# EAGLE schematic pro-base (EAGLE 9.6.2), part 1 of 2
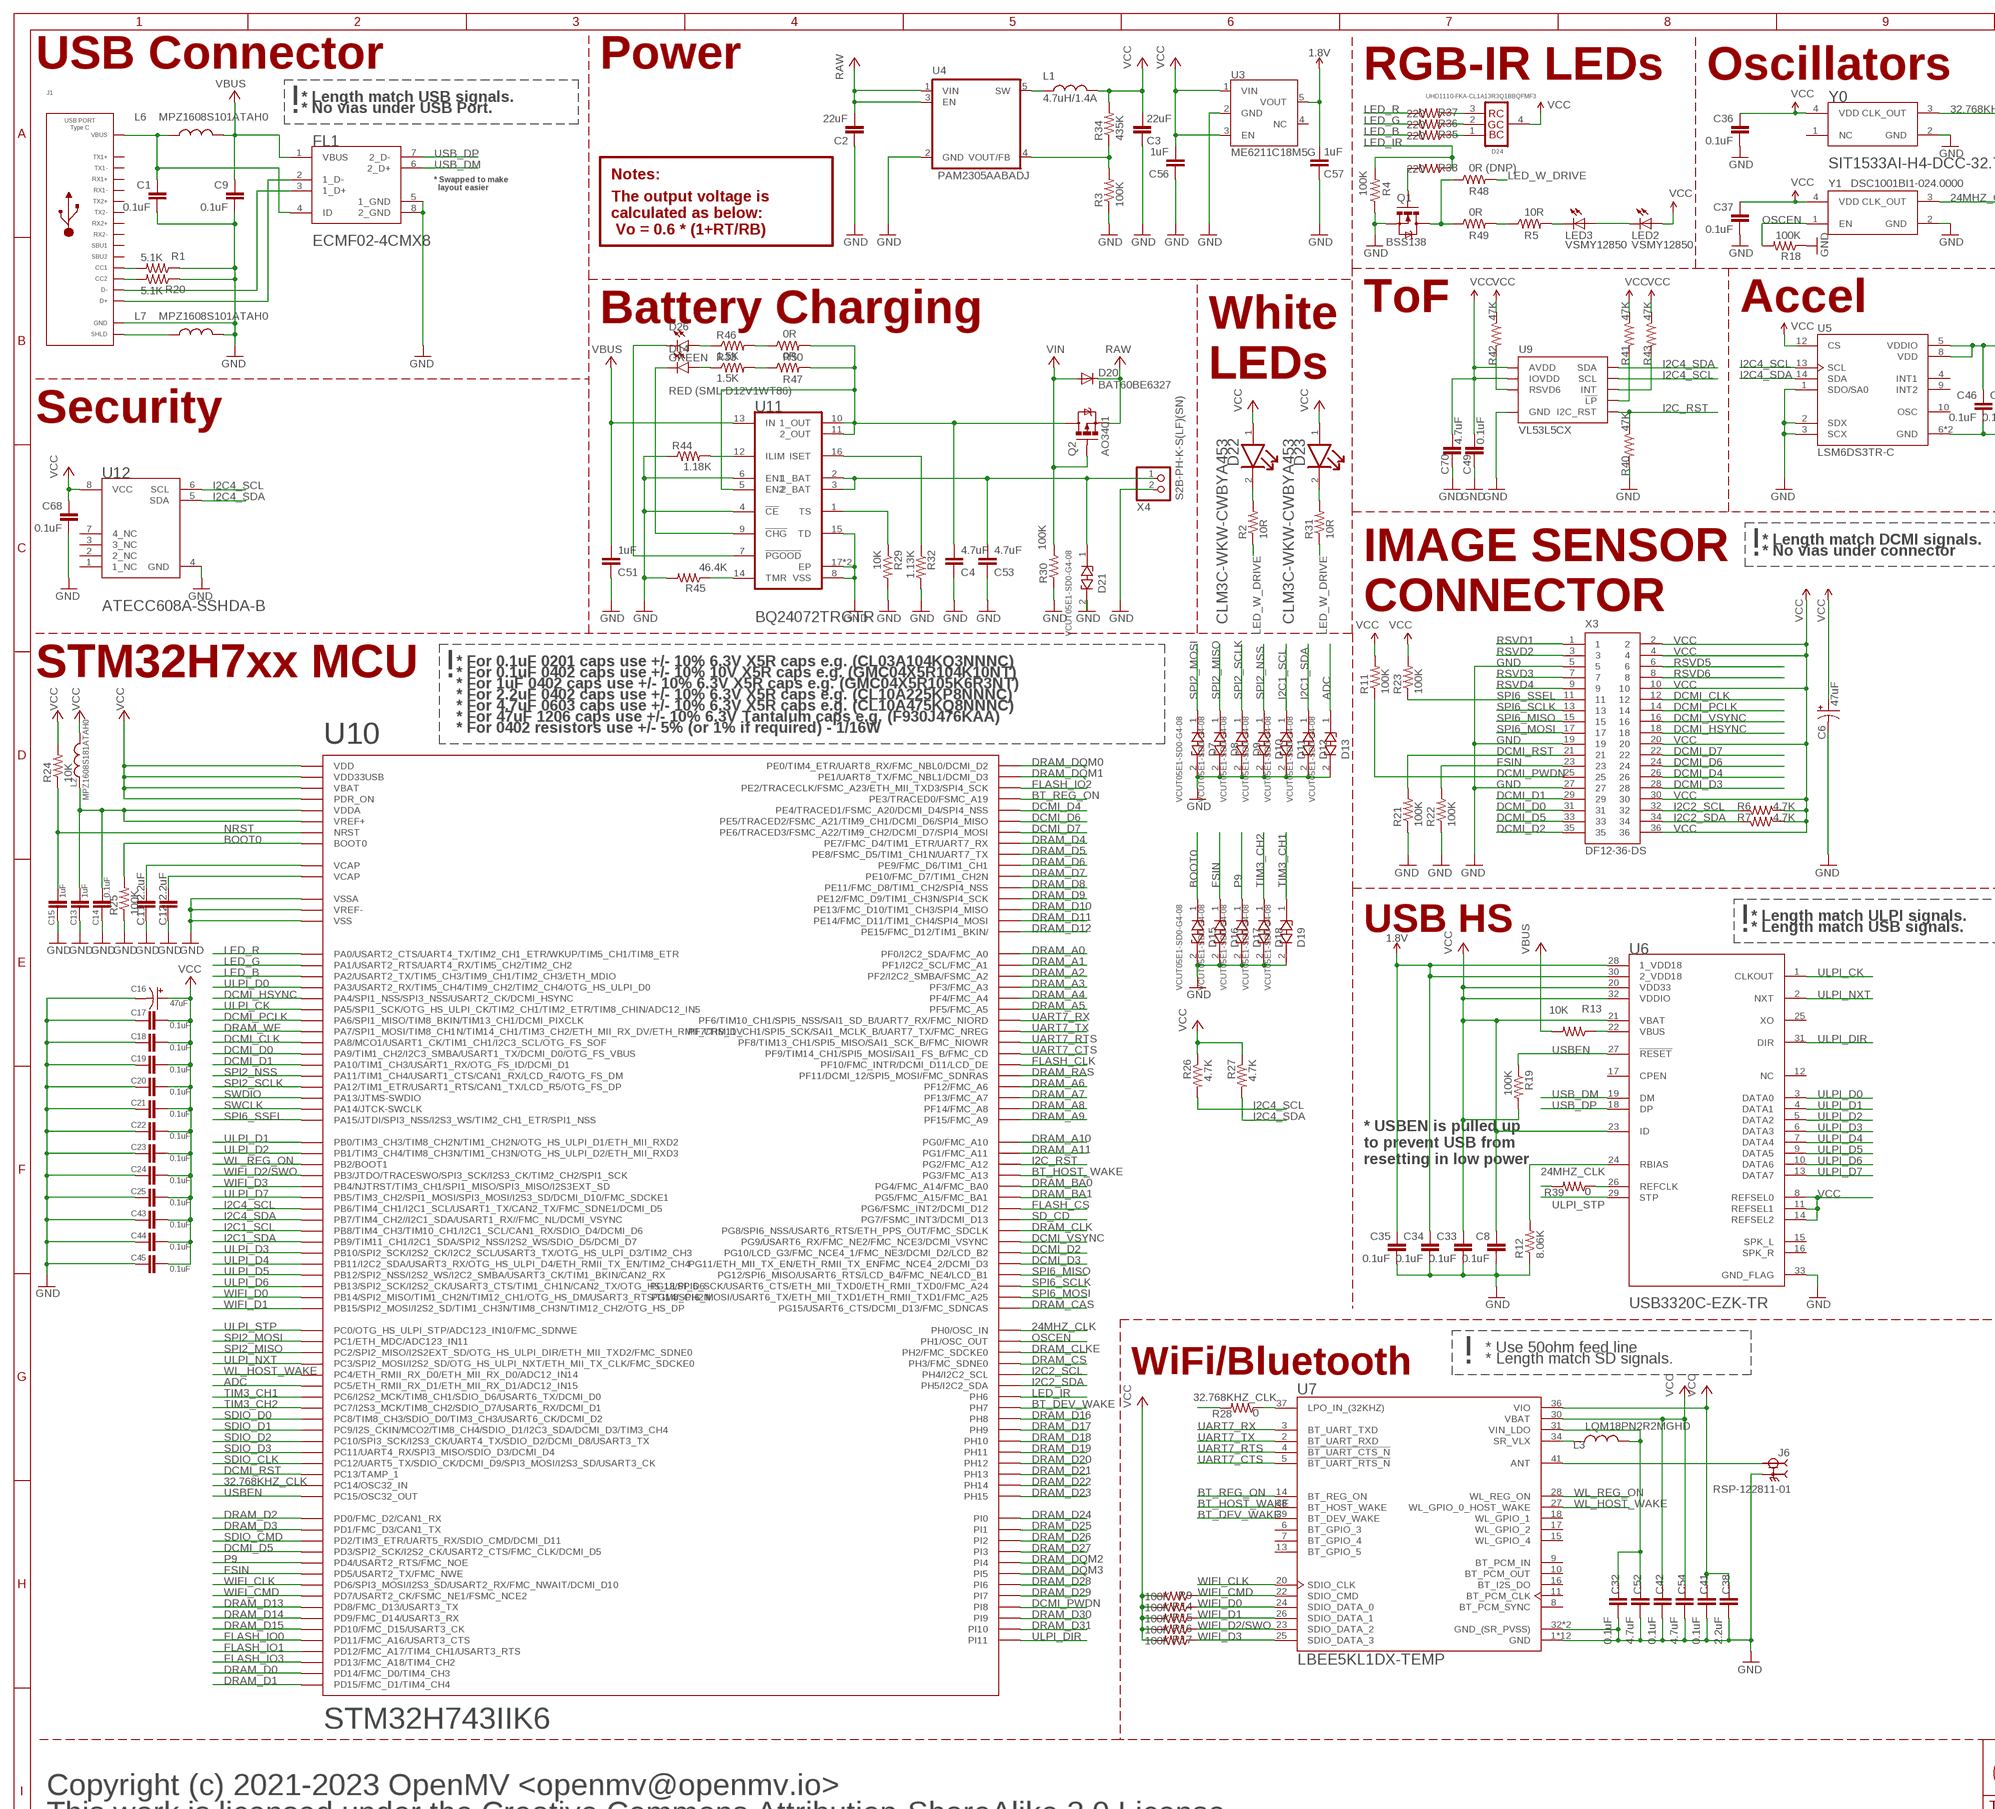
[diagram p0: schematic, sheet 1, part 1 of 2]
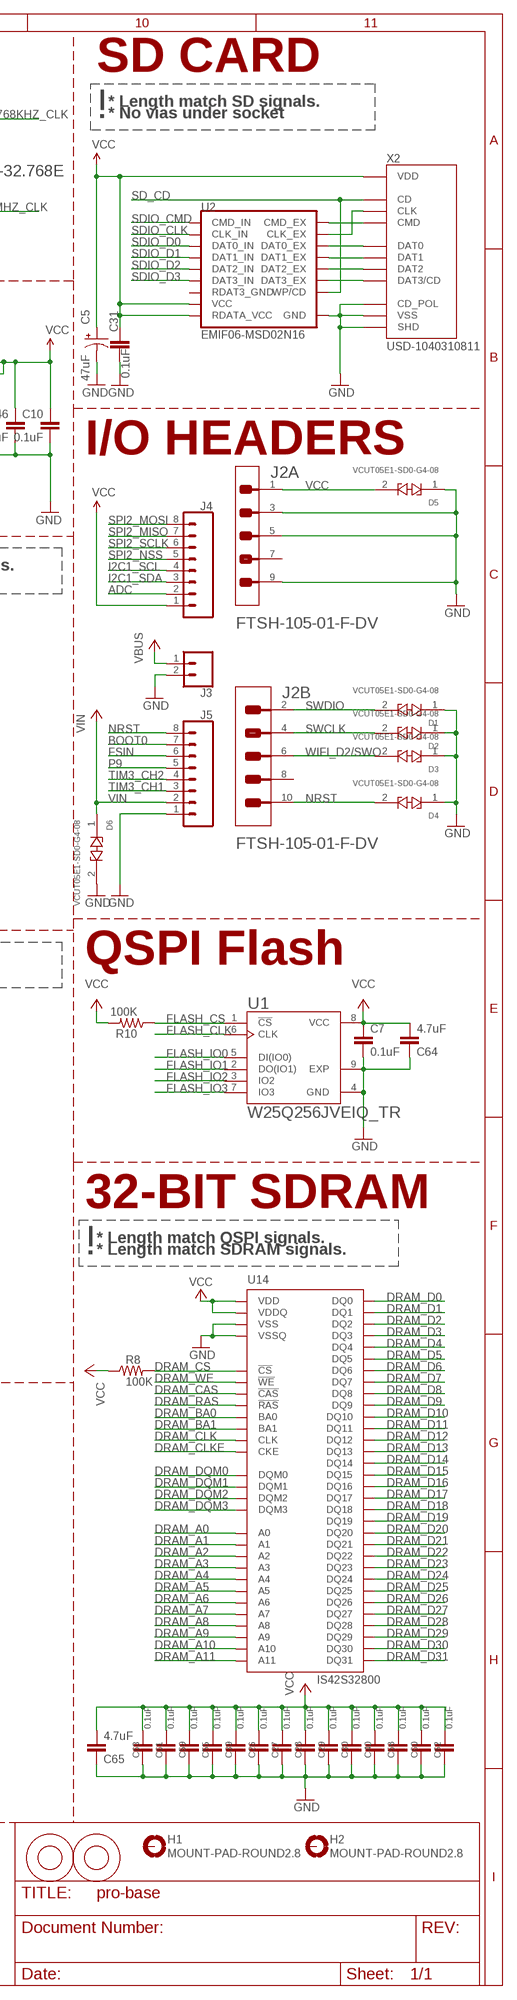
[diagram p1: schematic, sheet 1, part 2 of 2]

## Parts
C1  0.1uF  CAP0402-CAP  [0402-CAP]
C2  22uF  CAP0805  [0805]
C3  22uF  CAP0805  [0805]
C4  4.7uF  4.7UF0603  [0603]
C5  47uF  CAP_POL1206  [EIA3216]
C6  47uF  CAP_POL1206  [EIA3216]
C7  0.1uF  CAP0402-CAP  [0402-CAP]
C8  0.1uF  CAP0402-CAP  [0402-CAP]
C9  0.1uF  CAP0402-CAP  [0402-CAP]
C10  0.1uF  CAP0402-CAP  [0402-CAP]
C11  2.2uF  CAP0402-CAP  [0402-CAP]
C12  2.2uF  CAP0402-CAP  [0402-CAP]
C13  1uF  CAP0402-CAP  [0402-CAP]
C14  0.1uF  CAP0402-CAP  [0402-CAP]
C15  1uF  CAP0402-CAP  [0402-CAP]
C16  47uF  CAP_POL1206  [EIA3216]
C17  0.1uF  C-EUC0201  [C0201]
C18  0.1uF  C-EUC0201  [C0201]
C19  0.1uF  C-EUC0201  [C0201]
C20  0.1uF  C-EUC0201  [C0201]
C21  0.1uF  C-EUC0201  [C0201]
C22  0.1uF  C-EUC0201  [C0201]
C23  0.1uF  C-EUC0201  [C0201]
C24  0.1uF  C-EUC0201  [C0201]
C25  0.1uF  C-EUC0201  [C0201]
C26  0.1uF  C-EUC0201  [C0201]
C27  0.1uF  C-EUC0201  [C0201]
C28  0.1uF  C-EUC0201  [C0201]
C29  0.1uF  C-EUC0201  [C0201]
C30  0.1uF  C-EUC0201  [C0201]
C31  0.1uF  CAP0402-CAP  [0402-CAP]
C32  0.1uF  CAP0402-CAP  [0402-CAP]
C33  0.1uF  CAP0402-CAP  [0402-CAP]
C34  0.1uF  CAP0402-CAP  [0402-CAP]
C35  0.1uF  CAP0402-CAP  [0402-CAP]
C36  0.1uF  CAP0402-CAP  [0402-CAP]
C37  0.1uF  CAP0402-CAP  [0402-CAP]
C38  2.2uF  CAP0402-CAP  [0402-CAP]
C39  0.1uF  C-EUC0201  [C0201]
C40  0.1uF  C-EUC0201  [C0201]
C41  0.1uF  CAP0402-CAP  [0402-CAP]
C42  0.1uF  CAP0402-CAP  [0402-CAP]
C43  0.1uF  C-EUC0201  [C0201]
C44  0.1uF  C-EUC0201  [C0201]
C45  0.1uF  C-EUC0201  [C0201]
C46  0.1uF  CAP0402-CAP  [0402-CAP]
C49  0.1uF  CAP0402-CAP  [0402-CAP]
C51  1uF  CAP0402-CAP  [0402-CAP]
C52  4.7uF  4.7UF0603  [0603]
C53  4.7uF  4.7UF0603  [0603]
C54  4.7uF  4.7UF0603  [0603]
C55  0.1uF  C-EUC0201  [C0201]
C56  1uF  CAP0402-CAP  [0402-CAP]
C57  1uF  CAP0402-CAP  [0402-CAP]
C58  0.1uF  C-EUC0201  [C0201]
C59  0.1uF  C-EUC0201  [C0201]
C60  0.1uF  C-EUC0201  [C0201]
C61  0.1uF  C-EUC0201  [C0201]
C62  0.1uF  C-EUC0201  [C0201]
C63  0.1uF  C-EUC0201  [C0201]
C64  4.7uF  4.7UF0603  [0603]
C65  4.7uF  4.7UF0603  [0603]
C68  0.1uF  CAP0402-CAP  [0402-CAP]
C70  4.7uF  4.7UF0603  [0603]
D1  VISHAY_VCUT05E1-SD0-G4-08VISHAY_VCUT05E1-SD0-G4-08_0_0  [VISHAY_VCUT05E1-SD0-G4-08_0]
D2  VISHAY_VCUT05E1-SD0-G4-08VISHAY_VCUT05E1-SD0-G4-08_0_0  [VISHAY_VCUT05E1-SD0-G4-08_0]
D3  VISHAY_VCUT05E1-SD0-G4-08VISHAY_VCUT05E1-SD0-G4-08_0_0  [VISHAY_VCUT05E1-SD0-G4-08_0]
D4  VISHAY_VCUT05E1-SD0-G4-08VISHAY_VCUT05E1-SD0-G4-08_0_0  [VISHAY_VCUT05E1-SD0-G4-08_0]
D5  VISHAY_VCUT05E1-SD0-G4-08VISHAY_VCUT05E1-SD0-G4-08_0_0  [VISHAY_VCUT05E1-SD0-G4-08_0]
D6  VISHAY_VCUT05E1-SD0-G4-08VISHAY_VCUT05E1-SD0-G4-08_0_0  [VISHAY_VCUT05E1-SD0-G4-08_0]
D7  VISHAY_VCUT05E1-SD0-G4-08VISHAY_VCUT05E1-SD0-G4-08_0_0  [VISHAY_VCUT05E1-SD0-G4-08_0]
D8  VISHAY_VCUT05E1-SD0-G4-08VISHAY_VCUT05E1-SD0-G4-08_0_0  [VISHAY_VCUT05E1-SD0-G4-08_0]
D9  VISHAY_VCUT05E1-SD0-G4-08VISHAY_VCUT05E1-SD0-G4-08_0_0  [VISHAY_VCUT05E1-SD0-G4-08_0]
D10  VISHAY_VCUT05E1-SD0-G4-08VISHAY_VCUT05E1-SD0-G4-08_0_0  [VISHAY_VCUT05E1-SD0-G4-08_0]
D11  VISHAY_VCUT05E1-SD0-G4-08VISHAY_VCUT05E1-SD0-G4-08_0_0  [VISHAY_VCUT05E1-SD0-G4-08_0]
D12  VISHAY_VCUT05E1-SD0-G4-08VISHAY_VCUT05E1-SD0-G4-08_0_0  [VISHAY_VCUT05E1-SD0-G4-08_0]
D13  VISHAY_VCUT05E1-SD0-G4-08VISHAY_VCUT05E1-SD0-G4-08_0_0  [VISHAY_VCUT05E1-SD0-G4-08_0]
D14  RED (SML-D12V1WT86)  LED-RED0603  [LED-0603]
D15  VISHAY_VCUT05E1-SD0-G4-08VISHAY_VCUT05E1-SD0-G4-08_0_0  [VISHAY_VCUT05E1-SD0-G4-08_0]
D16  VISHAY_VCUT05E1-SD0-G4-08VISHAY_VCUT05E1-SD0-G4-08_0_0  [VISHAY_VCUT05E1-SD0-G4-08_0]
D17  VISHAY_VCUT05E1-SD0-G4-08VISHAY_VCUT05E1-SD0-G4-08_0_0  [VISHAY_VCUT05E1-SD0-G4-08_0]
D18  VISHAY_VCUT05E1-SD0-G4-08VISHAY_VCUT05E1-SD0-G4-08_0_0  [VISHAY_VCUT05E1-SD0-G4-08_0]
D19  VISHAY_VCUT05E1-SD0-G4-08VISHAY_VCUT05E1-SD0-G4-08_0_0  [VISHAY_VCUT05E1-SD0-G4-08_0]
D20  BAT60BE6327  DIODESOD  [SOD-323]
D21  VISHAY_VCUT05E1-SD0-G4-08VISHAY_VCUT05E1-SD0-G4-08_0_0  [VISHAY_VCUT05E1-SD0-G4-08_0]
D22  CREE_CLM3C-WKW-CWBYA453CREE_CLM3C-WKW-CWBYA453_0_0  [CREE_CLM3C-WKW-CWBYA453_0]
D23  CREE_CLM3C-WKW-CWBYA453CREE_CLM3C-WKW-CWBYA453_0_0  [CREE_CLM3C-WKW-CWBYA453_0]
D24  CREE_UHD1110-FKA-CL1A13R3Q1BBQFMF3CREE_UHD1110-FKA-CL1A13R3Q1BBQFMF3_0_0  [CREE_UHD1110-FKA-CL1A13R3Q1BBQFMF3_0]
D26  GREEN  LED-GREEN0603  [LED-0603]
FL1  STMICROELECTRONICS_ECMF02-4CMX8STMICROELECTRONICS_ECMF02-4CMX8_0_0  [STMICROELECTRONICS_ECMF02-4CMX8_0]
H1  MOUNT-PAD-ROUND2.8  [2,8-PAD]
H2  MOUNT-PAD-ROUND2.8  [2,8-PAD]
J1  USB_TYPE-C_105450-0101  [105450-0101]
J2  SAMTEC_FTSH-105-01-F-DVSAMTEC_FTSH-105-01-F-DV_0_0  [SAMTEC_FTSH-105-01-F-DV_0]
J3  CONN_02  [1X02]
J4  CONN_08"  [1X08]
J5  CONN_08"  [1X08]
J6  RSP-122811-01  [SAMTEC_RSP-122811-01]
L1  4.7uH/1.4A  INDUCTOR1007  [1007]
L2  MPZ1608S181ATAH0  INDUCTOR0402  [C0402]
L3  LQM18PN2R2MGHD  INDUCTOR0603  [0603]
L6  MPZ1608S101ATAH0  INDUCTOR0402  [C0402]
L7  MPZ1608S101ATAH0  INDUCTOR0402  [C0402]
LED2  VSMY12850  LED1206  [LED-1206]
LED3  VSMY12850  LED1206  [LED-1206]
M1  9774030243R  9774030151R  [9774030151R]
M2  9774030243R  9774030151R  [9774030151R]
Q1  BSS138  MOSFET-NCHANNELSMD  [SOT23-3]
Q2  AO3401  MOSFET-PCHANNELSMD  [SOT23-3]
R1  5.1K  RESISTOR0402-RES  [0402-RES]
R2  10R  RESISTOR0402-RES  [0402-RES]
R3  100K  RESISTOR0402-RES  [0402-RES]
R4  100K  RESISTOR0402-RES  [0402-RES]
R5  10R  RESISTOR0402-RES  [0402-RES]
R6  4.7K  RESISTOR0402-RES  [0402-RES]
R7  4.7K  RESISTOR0402-RES  [0402-RES]
R8  100K  RESISTOR0402-RES  [0402-RES]
R9  100K  RESISTOR0402-RES  [0402-RES]
R10  100K  RESISTOR0402-RES  [0402-RES]
R11  100K  RESISTOR0402-RES  [0402-RES]
R12  8.06K  RESISTOR0402-RES  [0402-RES]
R13  10K  RESISTOR0402-RES  [0402-RES]
R14  100K  RESISTOR0402-RES  [0402-RES]
R15  100K  RESISTOR0402-RES  [0402-RES]
R16  100K  RESISTOR0402-RES  [0402-RES]
R17  100K  RESISTOR0402-RES  [0402-RES]
R18  100K  RESISTOR0402-RES  [0402-RES]
R19  100K  RESISTOR0402-RES  [0402-RES]
R20  5.1K  RESISTOR0402-RES  [0402-RES]
R21  100K  RESISTOR0402-RES  [0402-RES]
R22  100K  RESISTOR0402-RES  [0402-RES]
R23  100K  RESISTOR0402-RES  [0402-RES]
R24  10K  RESISTOR0402-RES  [0402-RES]
R25  100K  RESISTOR0402-RES  [0402-RES]
R26  4.7K  RESISTOR0402-RES  [0402-RES]
R27  4.7K  RESISTOR0402-RES  [0402-RES]
R28  0  RESISTOR0402-RES  [0402-RES]
R29  10K  RESISTOR0402-RES  [0402-RES]
R30  100K  RESISTOR0402-RES  [0402-RES]
R31  10R  RESISTOR0402-RES  [0402-RES]
R32  1.13K  RESISTOR0402-RES  [0402-RES]
R33  1.5K  RESISTOR0402-RES  [0402-RES]
R34  435K  RESISTOR0402-RES  [0402-RES]
R35  220  RESISTOR0402-RES  [0402-RES]
R36  220  RESISTOR0402-RES  [0402-RES]
R37  220  RESISTOR0402-RES  [0402-RES]
R38  220  RESISTOR0402-RES  [0402-RES]
R39  0  RESISTOR0402-RES  [0402-RES]
R40  47K  RESISTOR0402-RES  [0402-RES]
R41  47K  RESISTOR0402-RES  [0402-RES]
R42  47K  RESISTOR0402-RES  [0402-RES]
R43  47K  RESISTOR0402-RES  [0402-RES]
R44  1.18K  RESISTOR0402-RES  [0402-RES]
R45  46.4K  RESISTOR0402-RES  [0402-RES]
R46  1.5K  RESISTOR0402-RES  [0402-RES]
R47  0R  RESISTOR0402-RES  [0402-RES]
R48  0R (DNP)  RESISTOR0402-RES  [0402-RES]
R49  0R  RESISTOR0402-RES  [0402-RES]
R50  0R  RESISTOR0402-RES  [0402-RES]
U1  W25Q256JVEIQ_TR  [SON127P800X600X80-9N]
U2  EMIF06-MSD02N16  [QFN3.5]
U3  ME6211C18M5G  ME6211TSOT-5  [SOT23-5]
U4  PAM2305AABADJ  PAM2305AAB330  [TSOT25]
U5  LSM6DS3TR-C  LSM6DS3  [PQFN50P300X250X86-14N]
U6  MICROCHIP_USB3320C-EZK-TRMICROCHIP_USB3320C-EZK-TR_0_1  [MICROCHIP_USB3320C-EZK-TR_1]
U7  LBEE5KL1DX-TEMP  [XCVR_LBEE5KL1DX-TEMP]
U9  VL53L5CX  [VL53L5CX]
U10  STM32H743IIK6  [UFGBGA-176]
U11  TEXAS_INSTRUMENTS_BQ24072TRGTRTEXAS_INSTRUMENTS_BQ24072TRGTR_0_0  [TEXAS_INSTRUMENTS_BQ24072TRGTR_0]
U12  MICROCHIP_ATECC608A-SSHDA-BMICROCHIP_ATECC608A-SSHDA-B_0_0  [MICROCHIP_ATECC608A-SSHDA-B_0]
U14  IS42S32800  [BGA90]
X2  USD-1040310811  [1040310811]
X3  DF12-36-DS  [DF12-36-DS]
X4  S2B-PH-K-S(LF)(SN)  JST_2PIN-THM-RA  [JST-PH-2-THM-RA]
Y0  SITIME_SIT1533AI-H4-DCC-32.768ESITIME_SIT1533AI-H4-DCC-32.768E_0_0  [SITIME_SIT1533AI-H4-DCC-32.768E_0]
Y1  DSC1001BI1-024.0000  OSC_DSC6083CI2A-032K768  [OSC_DSC6083CI2A-032K768]

## Nets
1.8V: C34.1 C35.1 C57.2 U3.5(VOUT) U6.28(1_VDD18) U6.30(2_VDD18)
24MHZ_CLK: R39.2 U10.G1(PH0/OSC_IN) Y1.3(CLK_OUT)
32.768KHZ_CLK: R28.2 U10.E1(PC14/OSC32_IN) Y0.3(CLK_OUT)
ADC: D13.1 J4.2 U10.P5(PC5/ETH_RMII_RX_D1/ETH_MII_RX_D1/ADC12_IN15)
ANT_PI_I: J6.1 U7.41(ANT)
BAT: C53.2 D21.1 U11.2(1_BAT) U11.3(2_BAT) X4.1
BOOT0: D15.1 J5.7 R25.2 U10.D6(BOOT0)
BT_DEV_WAKE: U7.39(BT_DEV_WAKE) U10.N12(PH7)
BT_HOST_WAKE: U7.38(BT_HOST_WAKE) U10.K15(PG3/FMC_A13)
BT_REG_ON: U7.14(BT_REG_ON) U10.A1(PE3/TRACED0/FSMC_A19)
CC1: J1.A5(CC1) R1.2
CC2: J1.B5(CC2) R20.2
CHG: D14.C U11.9(!CHG!)
CLK: U2.P$11(CLK_EX) X2.P$5(CLK)
CMD: U2.P$12(CMD_EX) X2.P$3(CMD)
DAT0: U2.P$10(DAT0_EX) X2.P$7(DAT0)
DAT1: U2.P$9(DAT1_EX) X2.P$8(DAT1)
DAT2: U2.P$14(DAT2_EX) X2.P$1(DAT2)
DAT3: U2.P$13(DAT3_EX) X2.P$2(DAT3/CD)
DCMI_CLK: U10.F15(PA8/MCO1/USART1_CK/TIM1_CH1/I2C3_SCL/OTG_FS_SOF) X3.12
DCMI_D0 [dcmi_data]: U10.E15(PA9/TIM1_CH2/I2C3_SMBA/USART1_TX/DCMI_D0/OTG_FS_VBUS) X3.31
DCMI_D1 [dcmi_data]: U10.D15(PA10/TIM1_CH3/USART1_RX/OTG_FS_ID/DCMI_D1) X3.29
DCMI_D2 [dcmi_data]: U10.B10(PG10/LCD_G3/FMC_NCE4_1/FMC_NE3/DCMI_D2/LCD_B2) X3.35
DCMI_D3 [dcmi_data]: U10.B9(PG11/ETH_MII_TX_EN/ETH_RMII_TX_ENFMC_NCE4_2/DCMI_D3) X3.28
DCMI_D4 [dcmi_data]: U10.B1(PE4/TRACED1/FSMC_A20/DCMI_D4/SPI4_NSS) X3.26
DCMI_D5 [dcmi_data]: U10.D11(PD3/SPI2_SCK/I2S2_CK/USART2_CTS/FMC_CLK/DCMI_D5) X3.33
DCMI_D6 [dcmi_data]: U10.B2(PE5/TRACED2/FSMC_A21/TIM9_CH1/DCMI_D6/SPI4_MISO) X3.24
DCMI_D7 [dcmi_data]: U10.B3(PE6/TRACED3/FSMC_A22/TIM9_CH2/DCMI_D7/SPI4_MOSI) X3.22
DCMI_HSYNC: U10.N4(PA4/SPI1_NSS/SPI3_NSS/USART2_CK/DCMI_HSYNC) X3.18
DCMI_PCLK: U10.P3(PA6/SPI1_MISO/TIM8_BKIN/TIM13_CH1/DCMI_PIXCLK) X3.14
DCMI_PWDN: R11.1 U10.D2(PI8) X3.25
DCMI_RST: R21.2 U10.D1(PC13/TAMP_1) X3.21
DCMI_VSYNC: U10.C10(PG9/USART6_RX/FMC_NE2/FMC_NCE3/DCMI_VSYNC) X3.16
DN: FL1.3(1_D+) J1.A7(D-) J1.B7(D-)
DP: FL1.2(1_D-) J1.A6(D+) J1.B6(D+)
DRAM_A0 [sdram_cmd]: U10.E2(PF0/I2C2_SDA/FMC_A0) U14.G8(A0)
DRAM_A1 [sdram_cmd]: U10.H3(PF1/I2C2_SCL/FMC_A1) U14.G9(A1)
DRAM_A2 [sdram_cmd]: U10.H2(PF2/I2C2_SMBA/FSMC_A2) U14.F7(A2)
DRAM_A3 [sdram_cmd]: U10.J2(PF3/FMC_A3) U14.F3(A3)
DRAM_A4 [sdram_cmd]: U10.J3(PF4/FMC_A4) U14.G1(A4)
DRAM_A5 [sdram_cmd]: U10.K3(PF5/FMC_A5) U14.G2(A5)
DRAM_A6 [sdram_cmd]: U10.P6(PF12/FMC_A6) U14.G3(A6)
DRAM_A7 [sdram_cmd]: U10.N6(PF13/FMC_A7) U14.H1(A7)
DRAM_A8 [sdram_cmd]: U10.R7(PF14/FMC_A8) U14.H2(A8)
DRAM_A9 [sdram_cmd]: U10.P7(PF15/FMC_A9) U14.J3(A9)
DRAM_A10 [sdram_cmd]: U10.N7(PG0/FMC_A10) U14.G7(A10)
DRAM_A11 [sdram_cmd]: U10.M7(PG1/FMC_A11) U14.H9(A11)
DRAM_BA0 [sdram_cmd]: U10.K14(PG4/FMC_A14/FMC_BA0) U14.J7(BA0)
DRAM_BA1 [sdram_cmd]: U10.K13(PG5/FMC_A15/FMC_BA1) U14.H8(BA1)
DRAM_CAS [sdram_cmd]: U10.B7(PG15/USART6_CTS/DCMI_D13/FMC_SDNCAS) U14.K7(!CAS)
DRAM_CLK [sdram_cmd]: U10.H14(PG8/SPI6_NSS/USART6_RTS/ETH_PPS_OUT/FMC_SDCLK) U14.J1(CLK)
DRAM_CLKE [sdram_cmd]: U10.F4(PH2/FMC_SDCKE0) U14.J2(CKE)
DRAM_CS [sdram_cmd]: R8.2 U10.G4(PH3/FMC_SDNE0) U14.J8(!CS)
DRAM_D0 [sdram_data]: U10.M14(PD14/FMC_D0/TIM4_CH3) U14.R8(DQ0)
DRAM_D1 [sdram_data]: U10.L14(PD15/FMC_D1/TIM4_CH4) U14.N7(DQ1)
DRAM_D2 [sdram_data]: U10.B12(PD0/FMC_D2/CAN1_RX) U14.R9(DQ2)
DRAM_D3 [sdram_data]: U10.C12(PD1/FMC_D3/CAN1_TX) U14.N8(DQ3)
DRAM_D4 [sdram_data]: U10.R8(PE7/FMC_D4/TIM1_ETR/UART7_RX) U14.P9(DQ4)
DRAM_D5 [sdram_data]: U10.P8(PE8/FSMC_D5/TIM1_CH1N/UART7_TX) U14.M8(DQ5)
DRAM_D6 [sdram_data]: U10.P9(PE9/FMC_D6/TIM1_CH1) U14.M7(DQ6)
DRAM_D7 [sdram_data]: U10.R9(PE10/FMC_D7/TIM1_CH2N) U14.L8(DQ7)
DRAM_D8 [sdram_data]: U10.P10(PE11/FMC_D8/TIM1_CH2/SPI4_NSS) U14.L2(DQ8)
DRAM_D9 [sdram_data]: U10.R10(PE12/FMC_D9/TIM1_CH3N/SPI4_SCK) U14.M3(DQ9)
DRAM_D10 [sdram_data]: U10.N11(PE13/FMC_D10/TIM1_CH3/SPI4_MISO) U14.M2(DQ10)
DRAM_D11 [sdram_data]: U10.P11(PE14/FMC_D11/TIM1_CH4/SPI4_MOSI) U14.P1(DQ11)
DRAM_D12 [sdram_data]: U10.R11(PE15/FMC_D12/TIM1_BKIN/) U14.N2(DQ12)
DRAM_D13 [sdram_data]: U10.P15(PD8/FMC_D13/USART3_TX) U14.R1(DQ13)
DRAM_D14 [sdram_data]: U10.P14(PD9/FMC_D14/USART3_RX) U14.N3(DQ14)
DRAM_D15 [sdram_data]: U10.N15(PD10/FMC_D15/USART3_CK) U14.R2(DQ15)
DRAM_D16 [sdram_data]: U10.M12(PH8) U14.E8(DQ16)
DRAM_D17 [sdram_data]: U10.M13(PH9) U14.D7(DQ17)
DRAM_D18 [sdram_data]: U10.L13(PH10) U14.D8(DQ18)
DRAM_D19 [sdram_data]: U10.L12(PH11) U14.B9(DQ19)
DRAM_D20 [sdram_data]: U10.K12(PH12) U14.C8(DQ20)
DRAM_D21 [sdram_data]: U10.E12(PH13) U14.A9(DQ21)
DRAM_D22 [sdram_data]: U10.E13(PH14) U14.C7(DQ22)
DRAM_D23 [sdram_data]: U10.D13(PH15) U14.A8(DQ23)
DRAM_D24 [sdram_data]: U10.E14(PI0) U14.A2(DQ24)
DRAM_D25 [sdram_data]: U10.D14(PI1) U14.C3(DQ25)
DRAM_D26 [sdram_data]: U10.C14(PI2) U14.A1(DQ26)
DRAM_D27 [sdram_data]: U10.C13(PI3) U14.C2(DQ27)
DRAM_D28 [sdram_data]: U10.C3(PI6) U14.B1(DQ28)
DRAM_D29 [sdram_data]: U10.C2(PI7) U14.D2(DQ29)
DRAM_D30 [sdram_data]: U10.D3(PI9) U14.D3(DQ30)
DRAM_D31 [sdram_data]: U10.E3(PI10) U14.E2(DQ31)
DRAM_DQM0 [sdram_cmd]: U10.A4(PE0/TIM4_ETR/UART8_RX/FMC_NBL0/DCMI_D2) U14.K9(DQM0)
DRAM_DQM1 [sdram_cmd]: U10.A3(PE1/UART8_TX/FMC_NBL1/DCMI_D3) U14.K1(DQM1)
DRAM_DQM2 [sdram_cmd]: U10.D4(PI4) U14.F8(DQM2)
DRAM_DQM3 [sdram_cmd]: U10.C4(PI5) U14.F2(DQM3)
DRAM_RAS [sdram_cmd]: U10.R6(PF11/DCMI_12/SPI5_MOSI/FMC_SDNRAS) U14.J9(!RAS)
DRAM_WE [sdram_cmd]: U10.R3(PA7/SPI1_MOSI/TIM8_CH1N/TIM14_CH1/TIM3_CH2/ETH_MII_RX_DV/ETH_RMII_CRS_DV) U14.K8(!WE)
FB [power]: R3.2 R34.1 U4.4(VOUT/FB)
FLASH_CLK: U1.6(CLK) U10.L1(PF10/FMC_INTR/DCMI_D11/LCD_DE)
FLASH_CS: R10.1 U1.1(!CS) U10.J15(PG6/FSMC_INT2/DCMI_D12)
FLASH_IO0: U1.5(DI(IO0)) U10.N14(PD11/FMC_A16/USART3_CTS)
FLASH_IO1: U1.2(DO(IO1)) U10.N13(PD12/FMC_A17/TIM4_CH1/USART3_RTS)
FLASH_IO2: U1.3(IO2) U10.A2(PE2/TRACECLK/FSMC_A23/ETH_MII_TXD3/SPI4_SCK)
FLASH_IO3: U1.7(IO3) U10.M15(PD13/FMC_A18/TIM4_CH2)
FSIN: D16.1 J5.6 R22.2 U10.C11(PD5/USART2_TX/FMC_NWE) X3.23
GND [gnd]: C1.2 C2.1 C3.1 C4.1 C5.C(-) C6.C(-) C7.2 C8.2 C9.2 C10.2 C11.2 C12.2 C13.2 C14.2 C15.2 C16.C(-) C17.2 C18.2 C19.2 C20.2 C21.2 C22.2 C23.2 C24.2 C25.2 C26.2 C27.2 C28.2 C29.2 C30.2 C31.2 C32.2 C33.2 C34.2 C35.2 C36.2 C37.2 C38.2 C39.2 C40.2 C41.2 C42.2 C43.2 C44.2 C45.2 C46.2 C49.2 C51.1 C52.2 C53.1 C54.2 C55.2 C56.1 C57.1 C58.2 C59.2 C60.2 C61.2 C62.2 C63.2 C64.1 C65.1 C68.2 C70.1 D1.1 D2.1 D3.1 D4.1 D5.1 D6.2 D7.2 D8.2 D9.2 D10.2 D11.2 D12.2 D13.2 D15.2 D16.2 D17.2 D18.2 D19.2 D21.2 FL1.5(1_GND) FL1.8(2_GND) J1.A1(GND) J1.A12(GND) J1.B1(GND) J1.B12(GND) J2.3 J2.5 J2.9 J3.2 J5.1 J6.G1(GND) J6.G2(GND) L7.2 Q1.2(S) R1.1 R3.1 R4.1 R12.1 R18.1 R20.1 R21.1 R22.1 R25.1 R29.2 R30.1 R32.2 R40.2 R44.1 R45.2 U1.4(GND) U1.9(EXP) U2.GND U3.2(GND) U4.2(GND) U5.1(SDO/SA0) U5.2(SDX) U5.3(SCX) U5.6(GND) U5.7(GND) U6.33(GND_FLAG) U7.1(GND) U7.12(GND) U7.19(GND) U7.21(GND) U7.29(GND) U7.32(GND_(SR_PVSS)) U7.33(GND_(SR_PVSS)) U7.35(GND) U7.40(GND) U7.42(GND) U7.43(GND) U7.44(GND) U7.45(GND) U7.46(GND) U9.A2(GND) U9.A6(GND) U9.A7(GND) U9.B4(GND) U9.C1(GND) U9.C6(GND) U9.C7(GND) U10.D5(VSS) U10.D7(VSS) U10.D8(VSS) U10.D9(VSS) U10.F2(VSS) U10.F6(VSS) U10.F7(VSS) U10.F8(VSS) U10.F9(VSS) U10.F10(VSS) U10.F12(VSS) U10.G2(VSS) U10.G6(VSS) U10.G7(VSS) U10.G8(VSS) U10.G9(VSS) U10.G10(VSS) U10.G12(VSS) U10.H6(VSS) U10.H7(VSS) U10.H8(VSS) U10.H9(VSS) U10.H10(VSS) U10.H12(VSS) U10.J6(VSS) U10.J7(VSS) U10.J8(VSS) U10.J9(VSS) U10.J10(VSS) U10.K6(VSS) U10.K7(VSS) U10.K8(VSS) U10.K9(VSS) U10.K10(VSS) U10.L4(VSS) U10.M1(VSSA) U10.M8(VSS) U10.M9(VSS) U10.N1(VREF-) U11.4(!CE!) U11.6(EN1) U11.8(VSS) U11.15(TD) U11.17(EP) U11.17-2(EP) U12.4(GND) U14.A3(VSS) U14.B3(VSSQ) U14.B8(VSSQ) U14.C1(VSSQ) U14.D1(VSSQ) U14.E9(VSSQ) U14.F1(VSS) U14.L3(VSS) U14.L9(VSSQ) U14.M1(VSSQ) U14.N1(VSSQ) U14.P3(VSSQ) U14.P8(VSSQ) U14.R3(VSS) X2.CD$2(CD_POL) X2.G$1(SHD) X2.G$2(SHD) X2.G$3(SHD) X2.G$4(SHD) X2.P$6(VSS) X3.5 X3.19 X3.27 X4.2 Y0.2(GND) Y1.2(GND)
I2C1_SCL: D11.1 J4.4 U10.A5(PB8/TIM4_CH3/TIM10_CH1/I2C1_SCL/CAN1_RX/SDIO_D4/DCMI_D6)
I2C1_SDA: D12.1 J4.3 U10.B4(PB9/TIM11_CH1/I2C1_SDA/SPI2_NSS/I2S2_WS/SDIO_D5/DCMI_D7)
I2C2_SCL: R6.2 U10.H4(PH4/I2C2_SCL) X3.32
I2C2_SDA: R7.2 U10.J4(PH5/I2C2_SDA) X3.34
I2C4_SCL: R26.2 U5.13(SCL) U9.C4(SCL) U10.B6(PB6/TIM4_CH1/I2C1_SCL/USART1_TX/CAN2_TX/FMC_SDNE1/DCMI_D5) U12.6(SCL)
I2C4_SDA: R27.2 U5.14(SDA) U9.C3(SDA) U10.B5(PB7/TIM4_CH2//I2C1_SDA/USART1_RX//FMC_NL/DCMI_VSYNC) U12.5(SDA)
I2C_RST: R40.1 U9.A1(I2C_RST) U10.L15(PG2/FMC_A12)
ISET: R32.1 U11.16(ISET)
LED_B: R35.2 U10.P2(PA2/USART2_TX/TIM5_CH3/TIM9_CH1/TIM2_CH3/ETH_MDIO)
LED_B_INT: D24.1(BLUE_CATHODE) R35.1
LED_DRAIN: Q1.3(D) R48.1 R49.1
LED_G: R36.2 U10.N2(PA1/USART2_RTS/UART4_RX/TIM5_CH2/TIM2_CH2)
LED_G_INT: D24.2(GREEN_CATHODE) R36.1
LED_IR: R4.2 R38.1 U10.M11(PH6)
LED_IR_DRIVE: R5.1 R49.2
LED_IR_DRIVE_0: LED3.C R5.2
LED_IR_DRIVE_1: LED2.C LED3.A
LED_IR_INT: Q1.1(G) R38.2
LED_R: R37.2 U10.N3(PA0/USART2_CTS/UART4_TX/TIM2_CH1_ETR/WKUP/TIM5_CH1/TIM8_ETR)
LED_R_INT: D24.3(RED_CATHODE) R37.1
LED_W_DRIVE: R2.1 R31.1 R48.2
LED_W_DRIVE_0: D22.2(CATHODE) R2.2
LED_W_DRIVE_1: D23.2(CATHODE) R31.2
N$1: D26.A R46.1
N$2: R28.1 U7.37(LPO_IN_(32KHZ))
N$3: R39.1 U6.26(REFCLK)
N$4: R44.2 U11.12(ILIM)
N$5: R41.2 U9.A5(!LP)
N$6: R42.2 U9.C2(RSVD6)
N$7: R43.2 U9.A3(INT)
N$8: R45.1 U11.14(TMR)
N$9: D26.C U11.7(!PGOOD!)
N$10: D14.A R33.1
N$11: R33.2 R47.1
N$12: R46.2 R50.1
NRST: C15.1 D4.2 J2.10 J5.8 R24.1 U10.J1(NRST)
OSCEN: R18.2 U10.H1(PH1/OSC_OUT) Y1.1(EN)
OUT [power]: C4.2 Q2.3(D) R47.2 R50.2 U11.5(EN2) U11.10(1_OUT) U11.11(2_OUT)
P9: D17.1 J5.5 U10.D10(PD4/USART2_RTS/FMC_NOE)
RAW: C2.2 D20.1(C) Q2.2(S) U4.1(VIN) U4.3(EN)
RBIAS: R12.2 U6.24(RBIAS)
RSVD1: X3.1
RSVD2: X3.3
RSVD3: X3.7
RSVD4: X3.9
RSVD5: X3.6
RSVD6: X3.8
SD_CD: U2.P$1(WP/CD) U10.J14(PG7/FSMC_INT3/DCMI_D13) X2.CD$1(CD)
SDIO_CLK: U2.P$6(CLK_IN) U10.A12(PC12/UART5_TX/SDIO_CK/DCMI_D9/SPI3_MOSI/I2S3_SD/USART3_CK)
SDIO_CMD: U2.P$5(CMD_IN) U10.D12(PD2/TIM3_ETR/UART5_RX/SDIO_CMD/DCMI_D11)
SDIO_D0: U2.P$7(DAT0_IN) U10.G14(PC8/TIM8_CH3/SDIO_D0/TIM3_CH3/USART6_CK/DCMI_D2)
SDIO_D1: U2.P$8(DAT1_IN) U10.F14(PC9/I2S_CKIN/MCO2/TIM8_CH4/SDIO_D1/I2C3_SDA/DCMI_D3/TIM3_CH4)
SDIO_D2: U2.P$3(DAT2_IN) U10.B14(PC10/SPI3_SCK/I2S3_CK/UART4_TX/SDIO_D2/DCMI_D8/USART3_TX)
SDIO_D3: U2.P$4(DAT3_IN) U10.B13(PC11/UART4_RX/SPI3_MISO/SDIO_D3/DCMI_D4)
SHIELD_INT: J1.S_T1(SHLD) J1.S_T2(SHLD) J1.S_T3(SHLD) J1.S_T4(SHLD) L7.1
SPI2_MISO: D8.1 J4.7 U10.M4(PC2/SPI2_MISO/I2S2EXT_SD/OTG_HS_ULPI_DIR/ETH_MII_TXD2/FMC_SDNE0)
SPI2_MOSI: D7.1 J4.8 U10.M3(PC1/ETH_MDC/ADC123_IN11)
SPI2_NSS: D10.1 J4.5 U10.C15(PA11/TIM1_CH4/USART1_CTS/CAN1_RX/LCD_R4/OTG_FS_DM)
SPI2_SCLK: D9.1 J4.6 U10.B15(PA12/TIM1_ETR/USART1_RTS/CAN1_TX/LCD_R5/OTG_FS_DP)
SPI6_MISO: U10.B8(PG12/SPI6_MISO/USART6_RTS/LCD_B4/FMC_NE4/LCD_B1) X3.15
SPI6_MOSI: U10.A7(PG14/SPI6_MOSI/USART6_TX/ETH_MII_TXD1/ETH_RMII_TXD1/FMC_A25) X3.17
SPI6_SCLK: U10.A8(PG13/SPI6_SCK/USART6_CTS/ETH_MII_TXD0/ETH_RMII_TXD0/FMC_A24) X3.13
SPI6_SSEL: R23.1 U10.A13(PA15/JTDI/SPI3_NSS/I2S3_WS/TIM2_CH1_ETR/SPI1_NSS) X3.11
SR)VLX: L3.1 U7.34(SR_VLX)
SW: L1.1 U4.5(SW)
SWCLK: D2.2 J2.4 U10.A14(PA14/JTCK-SWCLK)
SWDIO: D1.2 J2.2 U10.A15(PA13/JTMS-SWDIO)
TIM3_CH1: D19.1 J5.3 U10.H15(PC6/I2S2_MCK/TIM8_CH1/SDIO_D6/USART6_TX/DCMI_D0)
TIM3_CH2: D18.1 J5.4 U10.G15(PC7/I2S3_MCK/TIM8_CH2/SDIO_D7/USART6_RX/DCMI_D1)
TS: R29.1 U11.1(TS)
UART7_CTS: U7.5(!BT_UART_RTS_N) U10.L2(PF9/TIM14_CH1/SPI5_MOSI/SAI1_FS_B/FMC_CD)
UART7_RTS: U7.4(!BT_UART_CTS_N) U10.L3(PF8/TIM13_CH1/SPI5_MISO/SAI1_SCK_B/FMC_NIOWR)
UART7_RX: U7.3(BT_UART_TXD) U10.K2(PF6/TIM10_CH1/SPI5_NSS/SAI1_SD_B/UART7_RX/FMC_NIORD)
UART7_TX: U7.2(BT_UART_RXD) U10.K1(PF7/TIM11_CH1/SPI5_SCK/SAI1_MCLK_B/UART7_TX/FMC_NREG)
ULPI_CK: U6.1(CLKOUT) U10.P4(PA5/SPI1_SCK/OTG_HS_ULPI_CK/TIM2_CH1/TIM2_ETR/TIM8_CHIN/ADC12_IN5)
ULPI_D0: U6.3(DATA0) U10.R2(PA3/USART2_RX/TIM5_CH4/TIM9_CH2/TIM2_CH4/OTG_HS_ULPI_D0)
ULPI_D1: U6.4(DATA1) U10.R5(PB0/TIM3_CH3/TIM8_CH2N/TIM1_CH2N/OTG_HS_ULPI_D1/ETH_MII_RXD2)
ULPI_D2: U6.5(DATA2) U10.R4(PB1/TIM3_CH4/TIM8_CH3N/TIM1_CH3N/OTG_HS_ULPI_D2/ETH_MII_RXD3)
ULPI_D3: U6.6(DATA3) U10.R12(PB10/SPI2_SCK/I2S2_CK/I2C2_SCL/USART3_TX/OTG_HS_ULPI_D3/TIM2_CH3)
ULPI_D4: U6.7(DATA4) U10.R13(PB11/I2C2_SDA/USART3_RX/OTG_HS_ULPI_D4/ETH_RMII_TX_EN/TIM2_CH4)
ULPI_D5: U6.9(DATA5) U10.P12(PB12/SPI2_NSS/I2S2_WS/I2C2_SMBA/USART3_CK/TIM1_BKIN/CAN2_RX)
ULPI_D6: U6.10(DATA6) U10.P13(PB13/SPI2_SCK/I2S2_CK/USART3_CTS/TIM1_CH1N/CAN2_TX/OTG_HS_ULPI_D6)
ULPI_D7: U6.13(DATA7) U10.A6(PB5/TIM3_CH2/SPI1_MOSI/SPI3_MOSI/I2S3_SD/DCMI_D10/FMC_SDCKE1)
ULPI_DIR: U6.31(DIR) U10.E4(PI11)
ULPI_NXT: U6.2(NXT) U10.M5(PC3/SPI2_MOSI/I2S2_SD/OTG_HS_ULPI_NXT/ETH_MII_TX_CLK/FMC_SDCKE0)
ULPI_STP: U6.29(STP) U10.M2(PC0/OTG_HS_ULPI_STP/ADC123_IN10/FMC_SDNWE)
USB_DM: FL1.6(2_D+) U6.19(DM)
USB_DP: FL1.7(2_D-) U6.18(DP)
USBEN: R19.1 U6.27(!RESET!) U10.F1(PC15/OSC32_OUT)
VBUS: C9.1 C51.2 FL1.1(VBUS) J3.1 L6.2 R13.2 U11.13(IN)
VBUS_INT: C1.1 FL1.4(ID) J1.A4(VBUS) J1.A9(VBUS) J1.B4(VBUS) J1.B9(VBUS) L6.1
VBUS_SENSE: R13.1 U6.22(VBUS)
VCAP1: C11.1 U10.F13(VCAP)
VCAP2: C12.1 U10.M10(VCAP)
VCC [power]: C3.2 C5.A(+) C6.A(+) C7.1 C8.1 C10.1 C16.A(+) C17.1 C18.1 C19.1 C20.1 C21.1 C22.1 C23.1 C24.1 C25.1 C26.1 C27.1 C28.1 C29.1 C30.1 C31.1 C33.1 C36.1 C37.1 C38.1 C39.1 C40.1 C41.1 C42.1 C43.1 C44.1 C45.1 C46.1 C49.1 C54.1 C55.1 C56.2 C58.1 C59.1 C60.1 C61.1 C62.1 C63.1 C64.2 C65.2 C68.1 C70.2 D5.2 D22.1(ANODE) D23.1(ANODE) D24.4(COMMON_ANODE) J2.1 J4.1 L1.2 L2.2 LED2.A R6.1 R7.1 R8.1 R9.2 R10.2 R11.2 R14.2 R15.2 R16.2 R17.2 R19.2 R23.2 R24.2 R26.1 R27.1 R34.2 R41.1 R42.1 R43.1 U1.8(VCC) U2.P$15(VCC) U2.P$16(RDATA_VCC) U3.1(VIN) U3.3(EN) U5.5(VDDIO) U5.8(VDD) U5.12(CS) U6.8(REFSEL0) U6.11(REFSEL1) U6.14(REFSEL2) U6.20(VDD33) U6.21(VBAT) U6.23(ID) U6.32(VDDIO) U7.30(VBAT) U7.36(VIO) U9.A4(IOVDD) U9.B1(AVDD) U9.B7(AVDD) U10.C1(VBAT) U10.C5(VDD) U10.C6(PDR_ON) U10.C7(VDD) U10.C8(VDD) U10.C9(VDD) U10.F3(VDD) U10.G3(VDD) U10.G13(VDD) U10.H13(VDD33USB) U10.J12(VDD) U10.J13(VDD) U10.K4(VDD) U10.N8(VDD) U10.N9(VDD) U10.N10(VDD) U12.8(VCC) U14.A7(VDD) U14.B2(VDDQ) U14.B7(VDDQ) U14.C9(VDDQ) U14.D9(VDDQ) U14.E1(VDDQ) U14.F9(VDD) U14.L1(VDDQ) U14.L7(VDD) U14.M9(VDDQ) U14.N9(VDDQ) U14.P2(VDDQ) U14.P7(VDDQ) U14.R7(VDD) X2.P$4(VDD) X3.2 X3.4 X3.10 X3.20 X3.30 X3.36 Y0.4(VDD) Y1.4(VDD)
VDDA: C13.1 C14.1 L2.1 U10.P1(VREF+) U10.R1(VDDA)
VIN: D6.1 D20.2(A) J5.2 Q2.1(G) R30.2
VIN_LDO: C32.1 C52.1 L3.2 U7.31(VIN_LDO)
WIFI_CLK: U7.20(SDIO_CLK) U10.B11(PD6/SPI3_MOSI/I2S3_SD/USART2_RX/FMC_NWAIT/DCMI_D10)
WIFI_CMD: R9.1 U7.22(SDIO_CMD) U10.A11(PD7/USART2_CK/FSMC_NE1/FSMC_NCE2)
WIFI_D0: R14.1 U7.24(SDIO_DATA_0) U10.R14(PB14/SPI2_MISO/TIM1_CH2N/TIM12_CH1/OTG_HS_DM/USART3_RTS/TIM8_CH2N)
WIFI_D1: R15.1 U7.26(SDIO_DATA_1) U10.R15(PB15/SPI2_MOSI/I2S2_SD/TIM1_CH3N/TIM8_CH3N/TIM12_CH2/OTG_HS_DP)
WIFI_D2/SWO: D3.2 J2.6 R16.1 U7.23(SDIO_DATA_2) U10.A10(PB3/JTDO/TRACESWO/SPI3_SCK/I2S3_CK/TIM2_CH2/SPI1_SCK)
WIFI_D3: R17.1 U7.25(SDIO_DATA_3) U10.A9(PB4/NJTRST/TIM3_CH1/SPI1_MISO/SPI3_MISO/I2S3EXT_SD)
WL_HOST_WAKE: U7.27(WL_GPIO_0_HOST_WAKE) U10.N5(PC4/ETH_RMII_RX_D0/ETH_MII_RX_D0/ADC12_IN14)
WL_REG_ON: U7.28(WL_REG_ON) U10.M6(PB2/BOOT1)
Unconnected: H1.B2,8(MOUNT) H2.B2,8(MOUNT) J1.A2(TX1+) J1.A3(TX1-) J1.A8(SBU1) J1.A10(RX2-) J1.A11(RX2+) J1.B2(TX2+) J1.B3(TX2-) J1.B8(SBU2) J1.B10(RX1-) J1.B11(RX1+) J2.7 J2.8 U2.P$2(RDAT3_GND) U3.4(NC) U5.4(INT1) U5.9(INT2) U5.10(OSC) U6.12(NC) U6.15(SPK_L) U6.16(SPK_R) U6.17(CPEN) U6.25(XO) U7.6(BT_GPIO_3) U7.7(BT_GPIO_4) U7.8(BT_PCM_SYNC) U7.9(BT_PCM_IN) U7.10(BT_PCM_OUT) U7.11(BT_PCM_CLK) U7.13(BT_GPIO_5) U7.15(WL_GPIO_4) U7.16(BT_I2S_DO) U7.17(WL_GPIO_2) U7.18(WL_GPIO_1) U12.1(1_NC) U12.2(2_NC) U12.3(3_NC) U12.7(4_NC) Y0.1(NC)

## Notes on the sheet
- USB Connector | Power | RGB-IR LEDs | Oscillators | SD CARD
- * Length match USB signals. | * Length match SD signals.
- ! | * No vias under USB Port. | ! | * No vias under socket
- Notes:
- * Swapped to make
    layout easier
- The output voltage is
  calculated as below:
   Vo = 0.6 * (1+RT/RB)
- Battery Charging | ToF | Accel
- White
  LEDs
- Security | I/O HEADERS
- * Length match DCMI signals.
- ! | * No vias under connector
- IMAGE SENSOR
  CONNECTOR
- * For 0.1uF 0201 caps use +/- 10% 6.3V X5R caps e.g. (CL03A104KQ3NNNC)
- STM32H7xx MCU | ! | * For 0.1uF 0402 caps use +/- 10% 10V X5R caps e.g. (GMC04X5R104K10NT)
- * For 1uF 0402 caps use +/- 10% 6.3V X5R caps e.g. (GMC04X5R105K6R3NT)
- * For 2.2uF 0402 caps use +/- 10% 6.3V X5R caps e.g. (CL10A225KP8NNNC)
- * For 4.7uF 0603 caps use +/- 10% 6.3V X5R caps e.g. (CL10A475KQ8NNNC)
- * For 47uF 1206 caps use +/- 10% 6.3V Tantalum caps e.g. (F930J476KAA)
- * For 0402 resistors use +/- 5% (or 1% if required) - 1/16W
- * Length match ULPI signals. | QSPI Flash
- USB HS | ! | * Length match USB signals.
- 32-BIT SDRAM
- * USBEN is pulled up
  to prevent USB from
  resetting in low power
- * Length match QSPI signals.
- ! | * Length match SDRAM signals.
- * Use 50ohm feed line
- WiFi/Bluetooth | ! | * Length match SD signals.
- Copyright (c) 2021-2023 OpenMV <openmv@openmv.io>
- This work is licensed under the Creative Commons Attribution-ShareAlike 3.0 License.
- To view a copy of this license, visit http://creativecommons.org/licenses/by-sa/3.0/